# Altium schematic sheet old_pwr.SchDoc
size A3; SheetNumber: 6; SheetTotal: 6
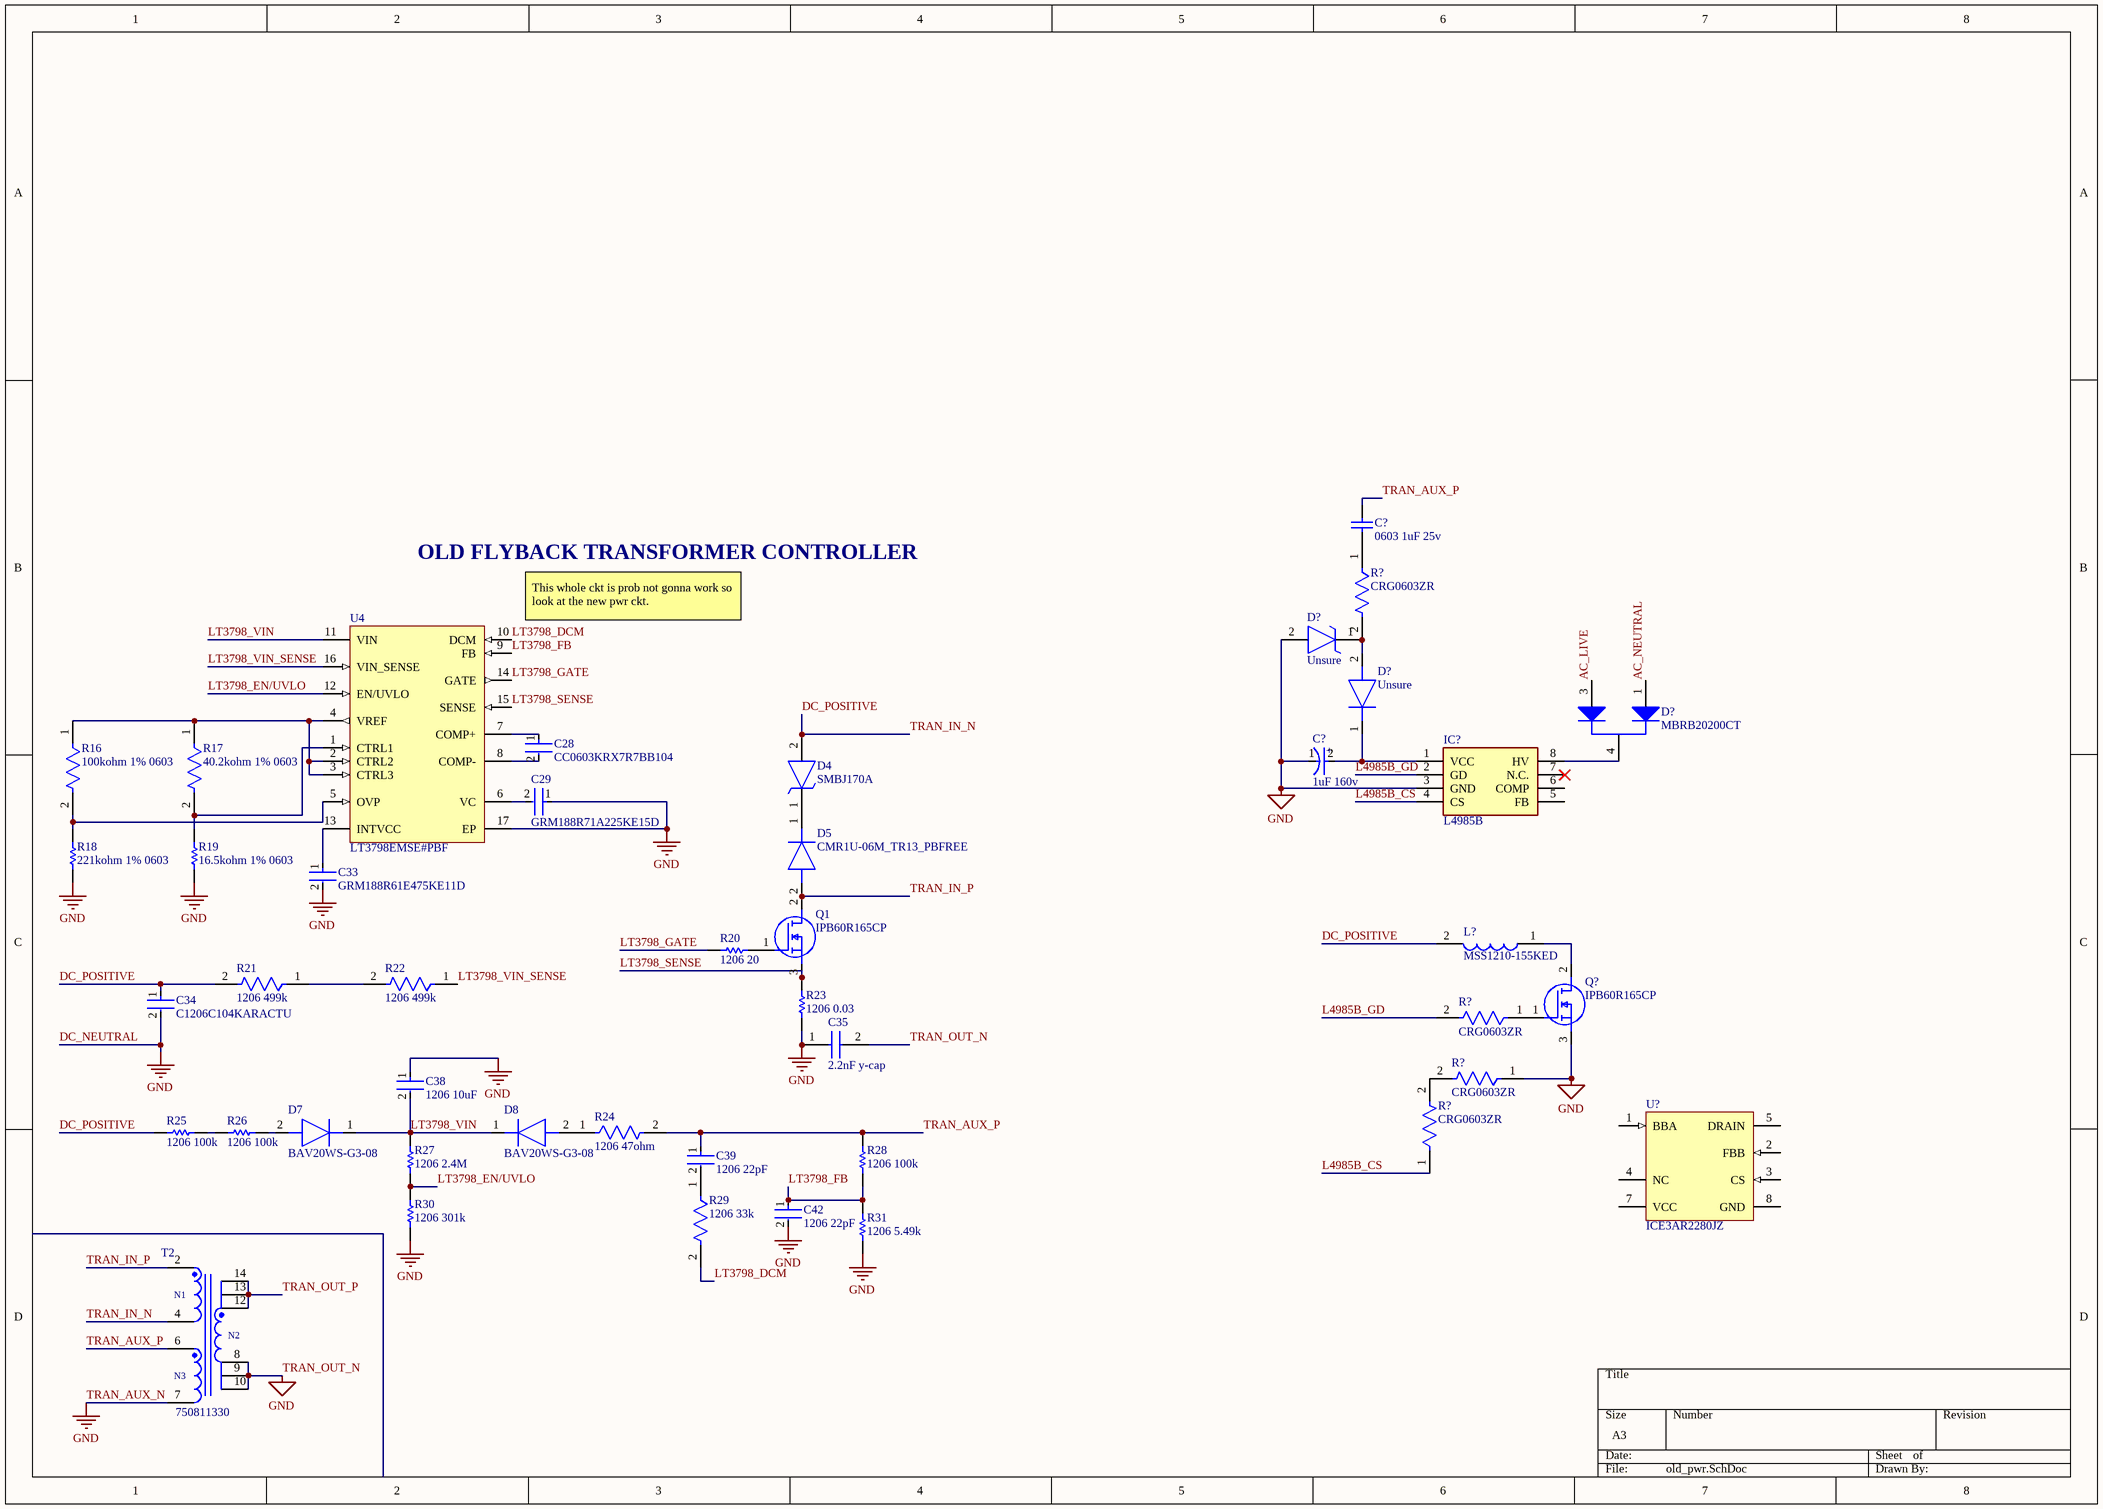
[diagram p0: old_pwr.SchDoc]

## Parts
(Parts that share a designator on the sheet are numbered #1, #2 ... from top to bottom, then left to right.)
C28  CC0603KRX7R7BB104  [FP-CC0603-DA-MFG]
C29  GRM188R71A225KE15D  [FP-GRM188-0_1-e0_2_0_5-MFG]
C33  GRM188R61E475KE11D  [FP-GRM188-0_15-IPC_C]
C34  C1206C104KARACTU  [FP-C1206C-EB-MFG]
C35  2.2nF y-cap  [MKY22W12203D00KSSD]
C38  1206 10uF  [FP-GRM31C-0_2-e0_3_0_8-MFG]
C39  1206 22pF  [FP-C1206C-EB-MFG]
C42  1206 22pF  [FP-C1206C-EB-MFG]
C?#1  0603 1uF 25v  [CAPC1608X87X35LL15T15]
C?#2  1uF 160v  [FP-ECA-2CHG010I-MFG]
D4  SMBJ170A  [DIOM5336X244N]
D5  CMR1U-06M_TR13_PBFREE  [DIOM5226X262N]
D7  BAV20WS-G3-08  [SOD2713X115N]
D8  BAV20WS-G3-08  [SOD2713X115N]
D?#1  Unsure  [DIOM5336X244N]
D?#2  MBRB20200CT  [ONSC-D2PAK-3-418B-04_V]
D?#3  Unsure  [DIOM5226X262N]
IC?  L4985B  [SOIC127P600X175-8N]
L?  MSS1210-155KED  [MSS1210155KED]
Q1  IPB60R165CP  [IPB60R165CP]
Q?  IPB60R165CP  [IPB60R165CP]
R16  100kohm 1% 0603  [FP-CRCW0603-e3-IPC_C]
R17  40.2kohm 1% 0603  [FP-ERJ3EK-IPC_C]
R18  221kohm 1% 0603  [RESC1608X55X25LL10T15]
R19  16.5kohm 1% 0603  [RESC1608X55X25NL10T15]
R20  1206 20  [RESC3216X70X40ML20T20]
R21  1206 499k  [FP-CRCW1206-e3-IPC_A]
R22  1206 499k  [FP-CRCW1206-e3-IPC_A]
R23  1206 0.03  [RESC3216X89X51NL25T25]
R24  1206 47ohm  [FP-CRCW1206-e3-IPC_C]
R25  1206 100k  [RESC3216X60X45NL10T20]
R26  1206 100k  [RESC3216X60X45NL10T20]
R27  1206 2.4M  [RESC3116X65X40NL10T20]
R28  1206 100k  [RESC3216X60X45NL10T20]
R29  1206 33k  [FP-CRCW1206-e3-IPC_B]
R30  1206 301k  [RESC3216X60X45NL10T20]
R31  1206 5.49k  [RESC3216X60X45LL10T20]
R?#1  CRG0603ZR  [FP-CRG0603-IPC_C]
R?#2  CRG0603ZR  [FP-CRG0603-IPC_C]
R?#3  CRG0603ZR  [FP-CRG0603-IPC_C]
R?#4  CRG0603ZR  [FP-CRG0603-IPC_C]
T2  750811330  [ETD34_750811330]
U4  LT3798EMSE#PBF  [LT-MSE-16-EDP_L]
U?  ICE3AR2280JZ  [INF-PG-DIP-7-1_A]

## Nets
DC_NEUTRAL: C29.1 C33.2 C34.2 C35.1 C35.2 C38.1 C42.2 C?#2.1(C) D?#1.2(A) IC?.3(GND) Q?.3(S) R18.2 R19.2 R23.2 R30.2 R31.2 R?#3.1 T2.7 T2.8 T2.9 T2.10 U4.17(EP)  [also labelled GND, TRAN_AUX_N, TRAN_OUT_N]
AC_LIVE: D?#2.3(A2)
AC_NEUTRAL: D?#2.1(A1)
DC_POSITIVE: C34.1 D4.2(A) L?.2 R21.2 R25.1 T2.4  [also labelled TRAN_IN_N]
L4985B_CS: IC?.4(CS) R?#4.1
L4985B_GD: IC?.2(GD) R?#2.2
LT3798_DCM: R29.2 U4.10(DCM)
LT3798_EN/UVLO: R27.2 R30.1 U4.12(EN/UVLO)
LT3798_FB: C42.1 R28.2 R31.1 U4.9(FB)
LT3798_GATE: R20.1 U4.14(GATE)
LT3798_SENSE: Q1.3(S) R23.1 U4.15(SENSE)
LT3798_VIN: C38.2 D7.1(K) D8.1(K) R27.1 U4.11(VIN)
LT3798_VIN_SENSE: R22.1 U4.16(VIN_SENSE)
TRAN_AUX_P: C39.1 C?#1.2 R24.2 R28.1 T2.6
TRAN_IN_P: D5.2(A) Q1.2(D) T2.2
TRAN_OUT_P: T2.12 T2.13 T2.14
NetC28_1: C28.1 U4.7(COMP+)
NetC28_2: C28.2 U4.8(COMP-)
NetC29_2: C29.2 U4.6(VC)
NetC33_1: C33.1 U4.13(INTVCC)
NetC39_2: C39.2 R29.1
NetC?#1_1: C?#1.1 R?#1.1
NetC?#2_2: C?#2.2(A) D?#3.1(K) IC?.1(VCC)
NetD4_1: D4.1(K) D5.1(K)
NetD7_2: D7.2(A) R26.2
NetD8_2: D8.2(A) R24.1
NetD?#1_1: D?#1.1(K) D?#3.2(A) R?#1.2
NetD?#2_4: D?#2.4(K) IC?.8(HV)
NetL?_1: L?.1 Q?.2(D)
NetQ1_1: Q1.1(G) R20.2
NetQ?_1: Q?.1(G) R?#2.1
NetR16_1: R16.1 R17.1 U4.2(CTRL2) U4.3(CTRL3) U4.4(VREF)
NetR16_2: R16.2 R18.1 U4.5(OVP)
NetR17_2: R17.2 R19.1 U4.1(CTRL1)
NetR21_1: R21.1 R22.2
NetR25_2: R25.2 R26.1
NetR?#3_2: R?#3.2 R?#4.2

Not connected (* = marked no-connect by the designer): IC? 5(FB) 6(COMP) 7(N.C.)*; U? 1(BBA) 2(FBB) 3(CS) 4(NC) 5(DRAIN) 7(VCC) 8(GND)

## Notes on the sheet
- OLD FLYBACK TRANSFORMER CONTROLLER
- (near U4) This whole ckt is prob not gonna work so look at the new pwr ckt.
- (in symbol CMP-012-00033-1) N1; N2; N3
- (in symbol CMP-05427-002176-1) +

## Library data of the parts
C28 = CMP-2000-05002-2: CAP CER 0.1UF 16V X7R 0603; Manufacturer: YAGEO; Tolerance: 0.1; Value: 100 nF; Temperature Coefficient: 15%; Material: Ceramic; Voltage Rating: 16 V; Package: CC0603-DA; ComponentLink2Description: Datasheet; Octopart: https://octopart.com/cc0603krx7r7bb104-yageo-192941; Temperature Range High: +125°C; Digikey Description: CAP CER 0.1UF 16V X7R 0603; Voltage: 16 V; Device Class L2: Capacitors; Height: 0.9mm; Temperature: -55°C to +125°C; Manufacturer Part Number: CC0603KRX7R7BB104; Device Class L1: Passive Components; Device Class L3: Ceramic Capacitors; ComponentLink2URL: http://www.yageo.com/documents/recent/UPY-GPHC_X7R_6.3V-to-50V_18.pdf; Footprint Url: http://www.yageo.com/exep/pages/download/literatures/UPY-C_GEN_24.pdf; RoHS: TRUE; Temperature Range Low: -55°C; Temperature Characteristic: X7R; Lead Free: Yes; Capacitance: 100 nF; Category: Cap; Mouser Description: Multilayer Ceramic Capacitor, CC Series, 0.1 - F, - 10%, X7R, 16 V, 0603 [1608 Metric]; Automotive: No
C29 = CMP-2006-02836-2: Chip Multilayer Ceramic Capacitors for General Purpose, 0603, 2.2uF, X7R, 15%, 10%, 10V; Case Code (Metric): 1608; Height: 0.8mm; Packaging: Cut Tape; Voltage: 10V; Lead Free: Lead Free; Min Operating Temperature: -55°C; Voltage Rating (DC): 10V; Max Operating Temperature: 125°C; Voltage Rating: 10V; Dielectric: X7R; Depth: 0.8mm; Case Code (Imperial): 0603; Termination: SMD/SMT; Case/Package: 0603; Number of Pins: 2; REACH SVHC: No SVHC; Mount: Surface Mount; Width: 0.031inch; Material: Ceramic; Capacitance: 2.2uF; Package Quantity: 1; Weight: 7.1E-05oz; Length: 1.6mm; Thickness: 0.035inch; Tolerance: 10%
C33 = CMP-2006-02523-2: Chip Multilayer Ceramic Capacitors for General Purpose, 0603, 4.7uF, X5R, 15%, 10%, 25V; Case Code (Metric): 1608; Max Operating Temperature: 85°C; REACH SVHC: No SVHC; Voltage Rating: 25V; Dielectric: X5R; Packaging: Cut Tape; Width: 0.031inch; Min Operating Temperature: -55°C; Lead Free: Lead Free; Capacitance: 4.7uF; Height: 0.8mm; Case Code (Imperial): 0603; Length: 1.6mm; Voltage Rating (DC): 25V; Case/Package: 0603; Voltage: 25V; Tolerance: 10%; Thickness: 0.031inch; Mount: Surface Mount; Material: Ceramic; Package Quantity: 4000; Depth: 0.8mm
C34 = CMP-1037-04229-2: CAP CER 0.1UF 250V X7R 1206; Manufacturer: KEMET; Material: Ceramic; Temperature Coefficient: 15%; Value: 0.10 μF; Tolerance: 0.1; Automotive Grade: Grade 0; Mouser Description: Multilayer Ceramic Capacitors MLCC - SMD/SMT 250volts 0.1uF X7R 10%; Height: 0.88mm; Device Class L3: Ceramic Capacitors; Temperature Range Low: -55°C; Automotive: Yes; ComponentLink2Description: Datasheet; Category: Cap; RoHS: TRUE; Manufacturer Part Number: C1206C104KARACTU; Temperature Range High: +150°C; Package: C1206C-EB; Device Class L2: Capacitors; Voltage Rating: 250 V; Lead Free: Yes; Temperature Characteristic: X7R; Digikey Description: CAP CER 0.1UF 250V X7R 1206; ComponentLink2URL: https://content.kemet.com/datasheets/KEM_C1007_X8R_ULTRA_150C_SMD.pdf; Device Class L1: Passive Components; Ipc Land Pattern Name: CAPC320160X78; Temperature: -55°C to +150°C; Capacitance: 0.10 μF; Octopart: https://octopart.com/c1206c104karactu-kemet-193627
C35 = MKY22W12203D00KSSD: Capacitor; Manufacturer_Name: WIMA; Datasheet Link: https://eu.mouser.com/datasheet/2/440/e_WIMA_MKP_Y2-1139883.pdf; Height: 9.5mm; Manufacturer_Part_Number: MKY22W12203D00KSSD; Mouser Part Number: 505-MKY22W12203DKSSD; Mouser Price/Stock: https://www.mouser.co.uk/ProductDetail/WIMA/MKY22W12203D00KSSD?qs=z5u5uZJqM4Oanxl7ljBHlQ%3D%3D
C38 = CMP-06035-003589-1: Chip Multilayer Ceramic Capacitors for General Purpose, 1206, 10uF, X7R, 15%, 10%, 25V; Case Code (Imperial): 1206; Voltage Rating (DC): 25V; Voltage Rating: 25V; Length: 3.2mm; Lead Free: Lead Free; Thickness: 0.071inch; Package Quantity: 1; Width: 1.6mm; Max Operating Temperature: 125°C; Number of Pins: 2; Height: 1.6mm; Case Code (Metric): 3216; REACH SVHC: No SVHC; Radiation Hardening: No; Case/Package: 1206; Material: Ceramic; Tolerance: 10%; Voltage: 25V; Mount: Surface Mount; Packaging: Tape and Reel; Dielectric: X7R; Termination: SMD/SMT; Min Operating Temperature: -55°C; Capacitance: 10uF; Depth: 1.6mm
C39 C42 = CMP-1037-00989-2: CAP CER 22PF 100V 5% NP0 1206; Manufacturer Part Number: C1206C220J1GACTU; Manufacturer: KEMET; Material: Ceramic; Automotive Grade: Grade 0; Tolerance: 0.05; Temperature Characteristic: C0G; Temperature Coefficient: 15%; Capacitance: 22 pF; Value: 22 pF; Mouser Description: 1206 22pF Ceramic Multilayer Capacitor; 100VDC; 125degC; C0G Dielec; +/-5% SMD; ComponentLink2Description: Datasheet; Digikey Description: CAP CER 22PF 100V 5% NP0 1206; Automotive: Yes; Temperature: -55°C to +150°C; Lead Free: Yes; Height: 0.88mm; Device Class L3: Ceramic Capacitors; Ipc Land Pattern Name: CAPC320160X78; ComponentLink2URL: https://content.kemet.com/datasheets/KEM_C1007_X8R_ULTRA_150C_SMD.pdf; Temperature Range High: +150°C; Device Class L1: Passive Components; Temperature Range Low: -55°C; Voltage Rating: 100 V; Category: Cap; Device Class L2: Capacitors; Octopart: https://octopart.com/c1206c220j1gactu-kemet-9145181; RoHS: TRUE; Package: C1206C-EB
C?#1 = CMP-2006-03713-1: Part Number: C0603C105K3RACTU; Manufacturer: Kemet
C?#2 = CMP-05427-002176-1: CAP ALUM 1UF 20% 160V RADIAL; Lead/Base Style: Straight; Ripple Current: 17mA; Life (Hours): 2000Hour; Voltage Rating (DC): 160V; Max Operating Temperature: 105°C; Radiation Hardening: No; Min Operating Temperature: -25°C; Packaging: Ammo Pack; Series: NHG; Capacitance: 1uF; Height - Seated (Max): 0.48inch; Lead Pitch: 2.5mm; Diameter: 6.3mm; Length: 11.2mm; Package Quantity: 2000; Termination: Radial; RoHS Compliant: Yes; Voltage Rating: 160V; Tolerance: 20%; Height: 11.2mm; Case/Package: Radial; Mount: Through Hole
D4 D?#1 = SMBJ170A: TVS Diode (Uni-directional); Manufacturer_Name: HY Electronic; Height: 2.44mm; Manufacturer_Part_Number: SMBJ170A
D5 D?#3 = CMR1U-06M_TR13_PBFREE: Diode; Manufacturer_Name: Central Semiconductor; Manufacturer_Part_Number: CMR1U-06M TR13 PBFREE; Datasheet Link: https://my.centralsemi.com/datasheets/CMR1U01M.PDF; Height: 2.62mm; Mouser Part Number: 610-CMR1U-06M; Mouser Price/Stock: https://www.mouser.co.uk/ProductDetail/Central-Semiconductor/CMR1U-06M-TR13-PBFREE/?qs=u16ybLDytRaiTbcu0RAPhw%3D%3D
D7 D8 = BAV20WS-G3-08: Diode; Manufacturer_Name: Vishay; Datasheet Link: https://componentsearchengine.com/Datasheets/1/BAV20WS-G3-08.pdf; Height: 1.15mm; Manufacturer_Part_Number: BAV20WS-G3-08; Mouser Part Number: 78-BAV20WS-G3-08; Mouser Price/Stock: https://www.mouser.co.uk/ProductDetail/Vishay-Semiconductors/BAV20WS-G3-08?qs=ROh%252BA47s9d2Jk9K4pPeq%252BQ%3D%3D; Arrow Part Number: BAV20WS-G3-08; Arrow Price/Stock: https://www.arrow.com/en/products/bav20ws-g3-08/vishay?region=nac
D?#2 = CMP-1055-00130-1: SWITCHMODE(TM) Power Rectifier, Dual Schottky Rectifiers, 3-Pin D2PAK, Tube; Manufacturer: On Semiconductor; Note1: 0; IFSM Max (A): 150; Configuration: Common Cathode; ComponentLink2Description: Datasheet; ComponentLink3Description: Package Specification; ComponentLink3URL: http://www.onsemi.com/pub_link/Collateral/418B-04.PDF; ComponentLink1URL: http://www.onsemi.com/; PackageReference: D2PAK-3-418B-04; ComponentLink2URL: http://www.onsemi.cn/pub_link/Collateral/MBRB20200CT-D.PDF; DatasheetVersion: Rev. 7; Mounting Technology: Surface Mount; Packing: Tube; PackageVersion: Rev. K, 09/2008; PackageDescription: 3-Pin Flange Mount, Body 9.145 x 9.97 mm, Pitch 2.54 mm; ComponentLink1Description: Manufacturer URL; PartNumber: MBRB20200CT; RoHS: FALSE
IC? = L4985B: Integrated Circuit; Manufacturer_Name: STMicroelectronics; Datasheet Link: https://www.st.com/resource/en/datasheet/l4985.pdf; Height: 1.75mm; Manufacturer_Part_Number: L4985B; Mouser Part Number: 511-L4985B; Mouser Price/Stock: https://www.mouser.co.uk/ProductDetail/STMicroelectronics/L4985B?qs=TCDPyi3sCW2vu0U49h065A%3D%3D
L? = MSS1210-155KED: Inductor; Manufacturer_Name: COILCRAFT; Datasheet Link: https://www.coilcraft.com/getmedia/f1a1bc5f-bdff-42f8-9ca8-1a0fb1d5094f/MSS1210.pdf; Height: 10.2mm; Manufacturer_Part_Number: MSS1210-155KED; Mouser Part Number: 994-MSS1210-155KED; Mouser Price/Stock: https://www.mouser.co.uk/ProductDetail/Coilcraft/MSS1210-155KED?qs=zCSbvcPd3pYRwhcmlJV9xg%3D%3D
Q1 Q? = IPB60R165CP: MOSFET (N-Channel); Manufacturer_Name: Infineon; Datasheet Link: https://www.infineon.com/dgdl/Infineon-IPB60R165CP-DS-v02_01-en.pdf?fileId=db3a304412b407950112b42dd38f48fc; Height: 4.826mm; Manufacturer_Part_Number: IPB60R165CP; Mouser Part Number: 726-IPB60R165CP; Mouser Price/Stock: https://www.mouser.co.uk/ProductDetail/Infineon-Technologies/IPB60R165CP?qs=mzcOS1kGbgdcrfUvmAosLQ%3D%3D
R16 = CMP-2000-03823-2: RES Thick Film, 100kΩ, 5%, 0.1W, 200ppm/°C, 0603; Power Rating: 100mW; Voltage Rating: 75V; Resistance: 100kR; Radiation Hardening: No; Min Operating Temperature: -55°C; Width: 0.85mm; Case Code (Metric): 1608; Max Power Dissipation: 100mW; Composition: Thick Film; Temperature Coefficient: 200ppm/°C; Tolerance: 5%; Termination: SMD/SMT; Military Standard: Not; Weight: 7.1E-05oz; Number of Pins: 2; Mount: Surface Mount; Depth: 0.85mm; Max Operating Temperature: 155°C; Case/Package: 0603; Working Voltage: 75V; Number of Terminations: 2; Package Quantity: 1; Case Code (Imperial): 0603; Contact Plating: Tin; Length: 1.55mm; Packaging: Tape and Reel; Height: 0.02inch; Features: Automotive AEC-Q200
R17 = CMP-2000-00486-2: RES SMD 40.2K OHM 1% 1/10W 0603; Power Rating: 100mW; Resistance: 40.2kR; Voltage Rating: 75V; Temperature Coefficient: 100ppm/°C; Voltage Rating (DC): 50V; Military Standard: Not; Lead Free: Lead Free; Resistor Type: Thick Film; Weight: 7.1E-05oz; Resistance Tolerance: 1%; Number of Terminations: 2; Min Operating Temperature: -55°C; Depth: 0.8mm; Max Power Dissipation: 100mW; Length: 1.6mm; Case Code (Imperial): 0603; Max Operating Temperature: 155°C; Series: ERJ; Radiation Hardening: No; Features: Automotive AEC-Q200; Mount: Surface Mount; Package Quantity: 1; Packaging: Tape and Reel; Height: 0.45mm; Width: 0.031inch; RoHS Compliant: Yes; Case/Package: 0603; Tolerance: 1%; Contact Plating: Tin; Technology: THICK FILM; Construction: Rectangular; Case Code (Metric): 1608; Termination: SMD/SMT
R18 = CMP-2000-03957-1: Part Number: RC0603FR-07221KL; Manufacturer: Yageo
R19 = CMP-2000-04912-1: Manufacturer: Yageo; Part Number: RC0603FR-0716K5L
R20 = CMP-2003-04567-1: Part Number: RK73B2BTTD200J; Manufacturer: KOA Speer
R21 R22 = CMP-1014-00815-3: RES Thick Film, 499kΩ, 1%, 0.25W, 100ppm/°C, 1206; Max Power Dissipation: 250mW; Resistance: 499kR; Voltage Rating (DC): 200V; Lead Free: Lead Free; Temperature Coefficient: 100ppm/°C; Package Quantity: 10; Packaging: Tape and Reel; Termination: Solder; Contact Plating: Tin; Depth: 1.6mm; Tolerance: 1%; Max Operating Temperature: 155°C; Features: Automotive AEC-Q200; Min Operating Temperature: -55°C; Width: 1.6mm; Composition: Thick Film; Military Standard: Not; Weight: 0.000353oz; Length: 3.2mm; Height: 0.55mm; Case/Package: 1206; Number of Terminations: 2; Power Rating: 250mW; Number of Pins: 2; Case Code (Metric): 3216; Radiation Hardening: No; Case Code (Imperial): 1206; Mount: Surface Mount; Voltage Rating: 200V
R23 = CMP-2003-04356-1: Manufacturer: Vishay Dale; Part Number: WSL1206R0300FEA
R24 = CMP-2003-02215-2: RES Thick Film, 47Ω, 1%, 0.25W, 100ppm/°C, 1206; Power Rating: 250mW; Resistance: 47R; Voltage Rating (DC): 200V; Contact Plating: Tin; Lead Free: Lead Free; Temperature Coefficient: 100ppm/°C; Length: 3.2mm; Package Quantity: 10; Number of Terminations: 2; Weight: 0.000353oz; Termination: SMD/SMT; Case Code (Metric): 3216; Mount: Surface Mount; Features: Automotive AEC-Q200; Max Power Dissipation: 250mW; Max Operating Temperature: 155°C; Height: 0.55mm; Depth: 1.6mm; Case Code (Imperial): 1206; Tolerance: 1%; Radiation Hardening: No; Composition: Thick Film; Min Operating Temperature: -55°C; Case/Package: 1206; Packaging: Tape and Reel; Voltage Rating: 200V; Width: 0.063inch; Military Standard: Not
R25 R26 R28 = CMP-1014-00736-2: Part Number: CRCW1206100KFKEA; Manufacturer: Vishay Dale
R27 = CMP-2003-03682-1: Manufacturer: Yageo; Part Number: RC1206FR-072M4L
R29 = CMP-2003-02103-2: RES Thick Film, 33kΩ, 1%, 0.25W, 100ppm/°C, 1206; Working Voltage: 200V; Resistance: 33kR; Power Rating: 250mW; Package Quantity: 10; Max Operating Temperature: 155°C; Height: 0.55mm; Length: 3.2mm; Lead Free: Lead Free; Contact Plating: Tin; Min Operating Temperature: -55°C; Voltage Rating (DC): 200V; Case Code (Metric): 3216; Depth: 1.6mm; Voltage Rating: 200V; Tolerance: 1%; Weight: 0.000353oz; Termination: SMD/SMT; Composition: Thick Film; Military Standard: Not; Features: Automotive AEC-Q200; Case Code (Imperial): 1206; Case/Package: 1206; Number of Terminations: 2; Packaging: Tape and Reel; Temperature Coefficient: 100ppm/°C; Width: 1.6mm; Max Power Dissipation: 250mW; Radiation Hardening: No
R30 = CMP-2003-02078-1: Manufacturer: Vishay Dale; Part Number: CRCW1206301KFKEA
R31 = CMP-2003-02301-1: Part Number: CRCW12065K49FKEA; Manufacturer: Vishay Dale
R?#1-R?#4 = CMP-03211-011415-1: RES SMD 0 OHM JUMPER 1/10W 0603; Voltage Rating: 50V; Resistance: 0mR; Power Rating: 100mW; Number of Resistors: 1; Tolerance: 0%; Temperature Coefficient: 100ppm/°C; Packaging: Tape and Reel; Series: CRG, Neohm; Technology: THICK FILM; Depth: 0.8mm; Width: 0.8mm; Min Operating Temperature: -55°C; Number of Terminations: 2; Length: 1.6mm; Weight: 7.1E-05oz; Resistor Type: Thick Film; Height: 0.45mm; Max Operating Temperature: 125°C; Case/Package: 0603; ELV: Compliant; Package Quantity: 5000; Radiation Hardening: No; RoHS Compliant: Yes; Termination: Solder; Case Code (Metric): 1608; Mount: Surface Mount; Case Code (Imperial): 0603; Max Power Dissipation: 100mW
T2 = CMP-012-00033-1: WE-OLLT Offline Flyback Transformer, THT, ETD34, Ui = 85 - 265V, Uo = 18V / 5A; Manufacturer: Wurth Elektronik; Switching Frequency: 200kHz; Saturation Current: 4A; Insulation Test Voltage: 4500V (AC); Input Voltage: 85 - 265V (AC); Inductance: 300uH; Width: 43.18mm; Auxiliary Voltage: 18V; Pins: 10; Output Current: 5A; Source: WE-OLLT.SchLib; Output Voltage: 18V; ComponentLink1URL: https://www.we-online.com/redexpert/article/750811330?ad; Manufacturer Part Number: 750811330; ComponentLink2URL: https://www.we-online.com/redexpert/spec/750811330?ad; Operating Temperature Min: -40°C; Operating Temperature Max: 125°C; Height: 30.48mm; Design Item ID: 750811330; ComponentLink2Description: Datasheet Link; Packaging: Tray; Category: Transformers For AC-DC Converter; Length: 39.6mm; Case/Package: ETD34; Mount: Through Hole; Match Code: WE-OLLT; ComponentLink1Description: Website Link; Component Type: Standard
U4 = CMP-0491-01149-1: Isolated No Opto-Coupler Flyback Controller with Active PFC, 16-pin SOP (MSE-16-EDP), -40 to 125 degC, Pb-Free; Manufacturer: Linear Technology; Number of Outputs: 1; PackageDescription: 16-Pin Plastic MSOP, Exposed Die Pad, Body 4.039 x 3 mm, Pitch 0.5 mm; ComponentLink2URL: http://cds.linear.com/docs/en/datasheet/3798fa.pdf; ComponentLink3Description: Package Specification; PackageReference: MSE-16; PartNumber: LT3798EMSE#PBF; DatasheetVersion: Rev. A; RoHS: TRUE; ComponentLink2Description: Datasheet; PackageVersion: Rev. F, 05/2013; ComponentLink3URL: http://cds.linear.com/docs/en/packaging/05081667_F_MSE16.pdf; Mounting Technology: Surface Mount; ComponentLink1URL: http://www.linear.com/; ComponentLink1Description: Manufacturer URL
U? = CMP-1102-00009-1: Off-Line SMPS Current Mode Controller with Integrated 800 V CoolMOS and Startup Cell (Brownout & Frequency Jitter), 10.5 to 25 V, -25 to 130 degC, PG-DIP-7-1, Tube, Green; Manufacturer: Infineon; Green: TRUE; Green Product: Lead Free; tf (typ): 30Â ns; RDS (on) (typ): 2.26Â Ohm; ESD Protection (max): 2Â kV; Frequency ( f ) Range: 100 kHz (fixed); RthJA (max): 96Â K/W; VCC (max): 25Â V; VCC (min): 10.5Â V; ICC (typ): 3.4Â mA; VDS (max): 800Â V; ID (max): 1.5Â A; PIN (max): 28Â W; DatasheetVersion: Rev. 2.1a; ComponentLink3URL: http://www.infineon.com/dgdl/Datasheet_ICE3BR0680JZ_V21a_11Jan2012.pdf?folderId=db3a30431f848401011fcbf221ff04c3&fileId=db3a304329a0f6ee0129e8b5bf735b64; ComponentLink3Description: Package Specification; PartNumber: ICE3AR2280JZ; ComponentLink2Description: Datasheet; PackageReference: PG-DIP-7-1; tr (typ): 30Â ns; PackageDescription: 7-Pin Plastic (Green) Dual In-Line Package, 9.44 x 6.35 mm Body, 2.54 mm Pitch; Mounting Technology: Through Hole; ComponentLink1URL: http://www.infineon.com/; ComponentLink2URL: http://www.infineon.com/dgdl/Datasheet_ICE3AR2280JZ_V21a_11Jan2012.pdf?folderId=db3a304412b407950112b4182a3d24f8&fileId=db3a3043284aacd801288a42141f2ad1; PackageVersion: Rev. 02, 07/2011; ComponentLink1Description: Manufacturer URL